# EAGLE design BlockController (EAGLE 7.6.0)
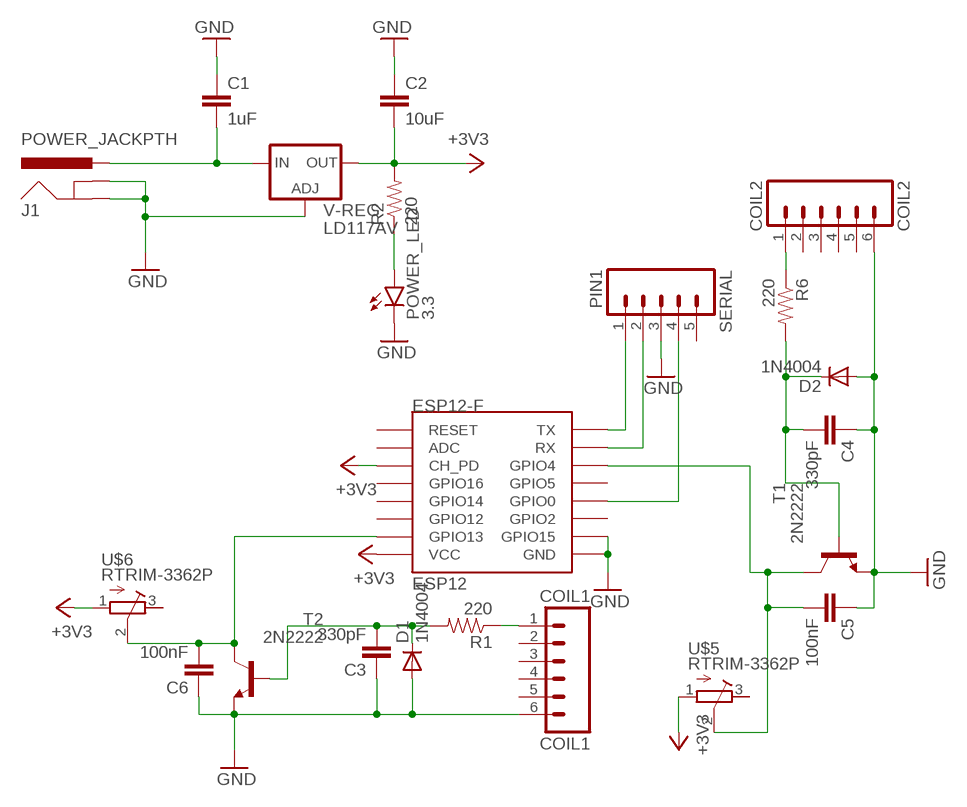
[diagram p0: schematic, sheet 1]

## Parts
C1  1uF  CAPPTH  [CAP-PTH-SMALL]
C2  10uF  CAPPTH  [CAP-PTH-SMALL]
C3  330pF  CAPPTH  [CAP-PTH-SMALL]
C4  330pF  CAPPTH  [CAP-PTH-SMALL]
C5  100nF  CAPPTH  [CAP-PTH-SMALL]
C6  100nF  CAPPTH  [CAP-PTH-SMALL]
COIL1  COIL1  M06  [06P]
COIL2  COIL2  M06  [06P]
D1  1N4004  [DO41-10]
D2  1N4004  [DO41-10]
ESP12-F  ESP12  [ESP12]
J1  POWER_JACKPTH  [POWER_JACK_PTH]
POWER_LED  3.3  LED5MM  [LED5MM]
R1  220  RESISTORPTH-1/4W  [AXIAL-0.4]
R2  220  RESISTORPTH-1/4W  [AXIAL-0.4]
R6  220  RESISTORPTH-1/4W  [AXIAL-0.4]
SERIAL  PIN1  M05  [05P]
T1  2N2222  [TO18]
T2  2N2222  [TO18]
U$5  RTRIM-3362P  [RTRIM3362P]
U$6  RTRIM-3362P  [RTRIM3362P]
V-REG  LD117AV  [TO220L1]

## Nets
+3V3: C2.2 ESP12-F.CH_PD ESP12-F.VCC R2.P$2 U$5.1 U$6.1 V-REG.2(OUT)
GND: C1.1 C2.1 C3.1 C4.1 C5.1 C6.1 COIL1.6 COIL2.6 D1.A D2.A ESP12-F.GND ESP12-F.GPIO15 J1.GND J1.GNDBREAK POWER_LED.K(C) SERIAL.3 T1.1(E) T2.1(E) V-REG.1(ADJ)
N$1: COIL1.1 R1.P$1
N$2: C3.2 D1.C R1.P$2 T2.2(B)
N$3: C4.2 D2.C R6.P$2 T1.2(B)
N$5: COIL2.1 R6.P$1
N$6: C5.2 ESP12-F.GPIO4 T1.3(C) U$5.2
N$7: POWER_LED.A R2.P$1
N$8: ESP12-F.TX SERIAL.1
N$9: ESP12-F.RX SERIAL.2
N$10: ESP12-F.GPIO0 SERIAL.4
N$18: C1.2 J1.PWR V-REG.3(IN)
N$20: C6.2 ESP12-F.GPIO13 T2.3(C) U$6.2
Unconnected: COIL1.2 COIL1.3 COIL1.4 COIL1.5 COIL2.2 COIL2.3 COIL2.4 COIL2.5 ESP12-F.ADC ESP12-F.GPIO2 ESP12-F.GPIO5 ESP12-F.GPIO12 ESP12-F.GPIO14 ESP12-F.GPIO16 ESP12-F.RESET SERIAL.5 U$5.3 U$6.3

## Library data of the parts
C1-C6 = SparkFun-Capacitors:CAP: Capacitor Standard 0603 ceramic capacitor, and 0.1" leaded capacitor.
COIL1 COIL2 = con-amp-quick:M06: AMP QUICK CONNECTOR; OC_FARNELL: unknown; OC_NEWARK: unknown
D1 D2 = diode:1N4004: DIODE general purpose rectifier, 1 A
ESP12-F = esp8266modules:ESP12: ESP8266 Wifi module 12
J1 = SparkFun-Connectors:POWER_JACK: Power Jack This is the standard 5.5mm barrel jack for power. The PTH is the most common, proven, reliable, footprint. The Slot footprint only works if the mill layer is transmitted to the PCB fab house so be warned. Mating wall wart : TOL-00298 (and others); PROD_ID: CONN-08197
POWER_LED = SparkFun-LED:LED: LEDs Standard schematic elements and footprints for 5mm, 3mm, 1206, and 0603 sized LEDs. 5mm - Spark Fun Electronics SKU : COM-00529 (and others)
R1 R2 R6 = SparkFun-Resistors:RESISTOR: Resistor Basic schematic elements and footprints for 0603, 1206, and PTH resistors.
SERIAL = con-amp-quick:M05: AMP QUICK CONNECTOR; OC_FARNELL: unknown; OC_NEWARK: unknown
T1 T2 = transistor-neu-to92:2N2222: NPN TRANSISTOR
U$5 U$6 = GeekAmmo:RTRIM: BOURNS 3362 - 1/4" Square Trimpot® Trimming Potentiometer
V-REG = v-reg:LD117A?*: Low drop fixed and adjustable positive voltage regulators 1 A Source: http://www.st.com/stonline/products/literature/ds/7194/ld1117axx.pdf

## Board
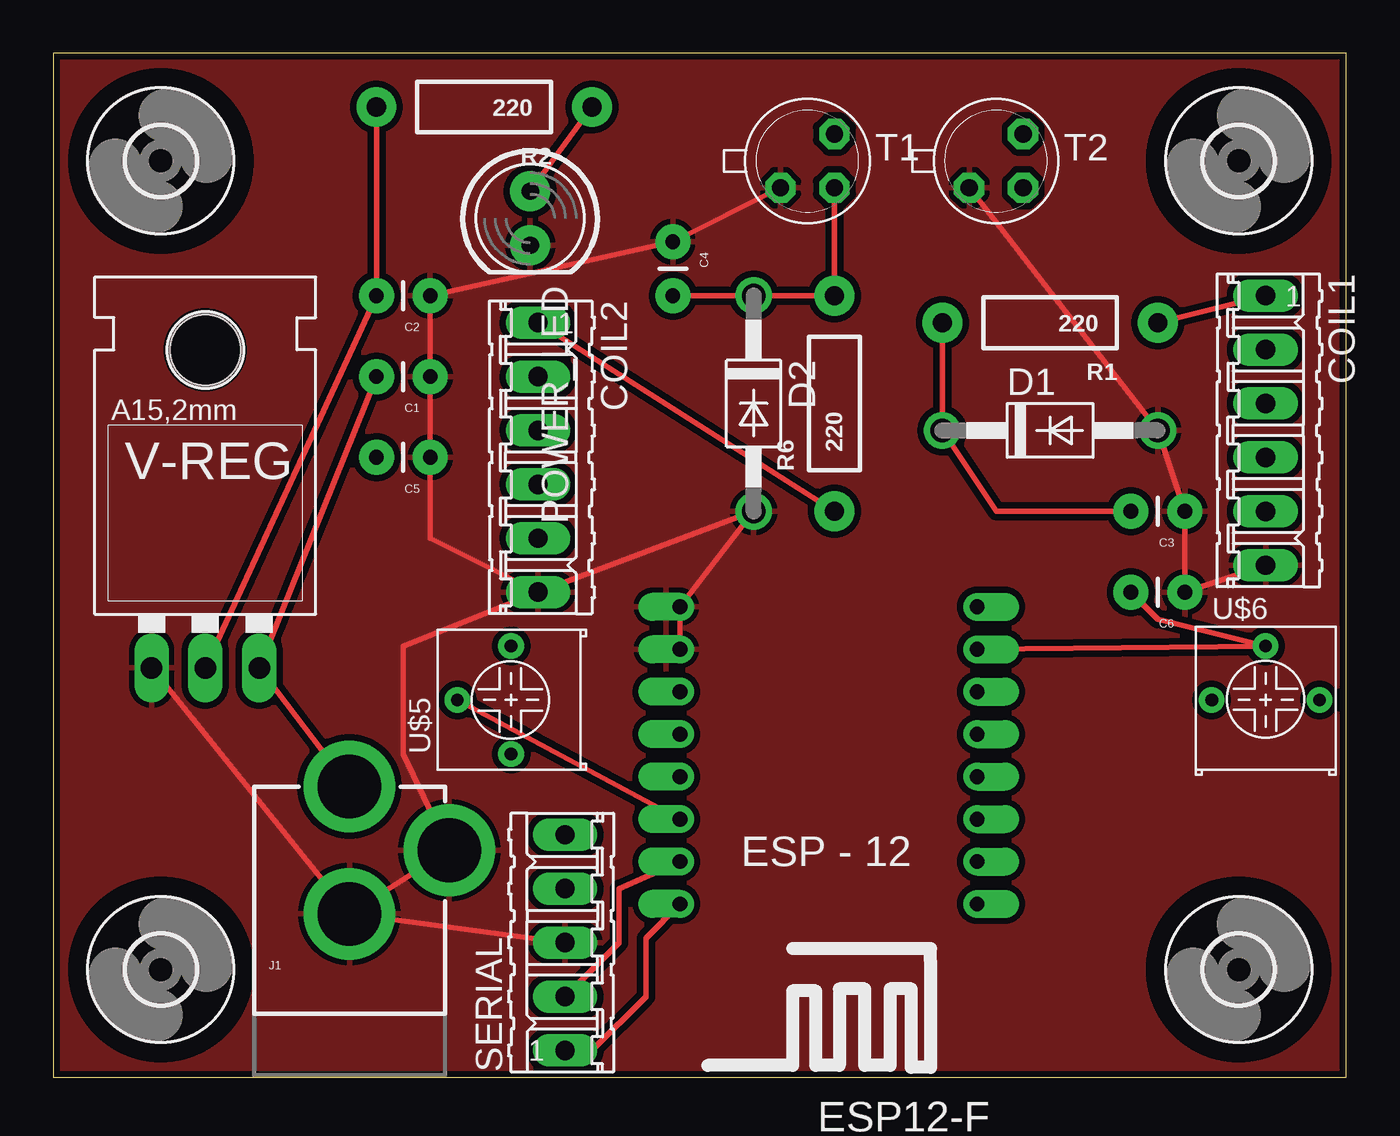
[diagram p1: board, top side]
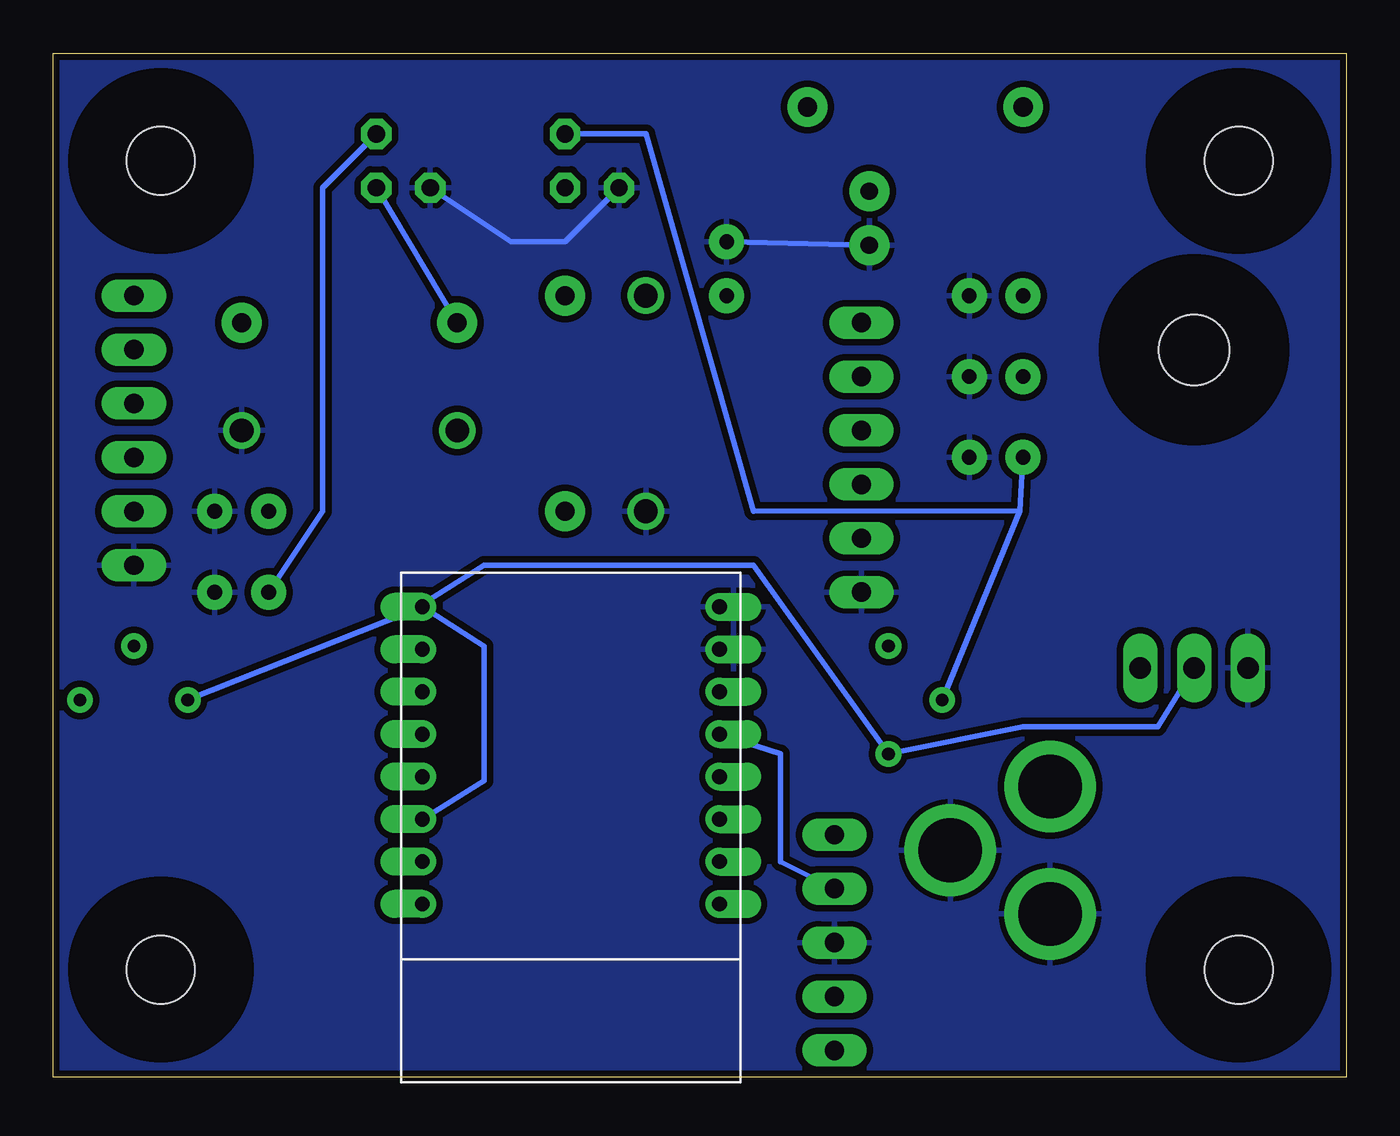
[diagram p2: board, bottom side, seen from below]

Size 60.96 x 48.26 mm. Coordinates in mm from the lower left corner, seen from the top.
Outline: 0,0 60.96,0 60.96,48.26 0,48.25 0,0
Copper layers (1*16): Top 0.035mm / dielectric 1.5mm / Bottom 0.035mm
Design rules "SparkFun": minimum track width 8mil, minimum drill 20mil, track to track 8mil, track to pad 8mil, pad to pad 8mil, via to via 8mil, smd to smd 8mil, copper to edge 8mil, drill to drill 8mil, minimum pad ring 12mil, minimum via ring 10mil, stop-mask expansion 4mil, vias tented up to drill 20mil, thermal gap 10mil

### Footprints (pad centres in the part's own frame; a part is rotated, then mirrored left to right if it is on the bottom)
CAP-PTH-SMALL = drill 0.7 pad 1.651: 1 0,0; 2 2.54,0
06P = drill 0.914 long: 1 -6.35,0; 2 -3.81,0; 3 -1.27,0; 4 1.27,0; 5 3.81,0; 6 6.35,0
DO41-10 = drill 1.118: A 5.08,0; C -5.08,0
ESP12 = drill 0.7 offset: ADC -7.1,3.8; CH_PD -7.1,1.8; GND 6.9,-8.2; GPIO0 6.9,-2.2; GPIO2 6.9,-4.2; GPIO4 6.9,1.8; GPIO5 6.9,-0.2; GPIO12 -7.1,-4.2; GPIO13 -7.1,-6.2; GPIO14 -7.1,-2.2; GPIO15 6.9,-6.2; GPIO16 -7.1,-0.2; RESET -7.1,5.8; RX 6.9,3.8; TX 6.9,5.8; VCC -7.1,-8.2
POWER_JACK_PTH = drill 2.997 pad 4.318: GND 0,7.7; GNDBREAK 4.7,10.7; PWR 0,13.7
LED5MM = drill 0.813 pad 1.88: A -1.27,0; K 1.27,0
AXIAL-0.4 = drill 0.9 pad 1.88: P$1 -5.08,0; P$2 5.08,0
05P = drill 0.914 long: 1 -5.08,0; 2 -2.54,0; 3 0,0; 4 2.54,0; 5 5.08,0
TO18 = drill 0.813 octagon: 1 -1.27,-1.27; 2 1.27,-1.27; 3 1.27,1.27
3,2 = hole 3.2: 0,0
RTRIM3362P = drill 0.6: 1 -2.54,-2.54; 2 0,0; 3 2.54,-2.54
TO220L1 = drill 1.016 long: 1 -2.54,-3.81; 2 0,-3.81; 3 2.54,-3.81 | hole 3.302: 0,11.176

### Placement (x,y rotation side)
C1  17.78,33.02 180 top
C2  17.78,36.83 180 top
C3  53.34,26.67 180 top
C4  29.21,39.37 270 top
C5  17.78,29.21 180 top
C6  53.34,22.86 180 top
COIL1  57.15,30.48 270 top
COIL2  22.86,29.21 270 top
D1  46.99,30.48 0 top
D2  33.02,31.75 270 top
ESP12-F  36.45,13.97 180 top
J1  13.97,0 0 top
POWER_LED  22.49,40.48 270 top
R1  46.99,35.56 180 top
R2  20.32,45.72 180 top
R6  36.83,31.75 90 top
SERIAL  24.13,6.35 90 top
T1  35.56,43.18 0 top
T2  44.45,43.18 0 top
U$1  [3,2]  5.08,43.18 0 top
U$2  [3,2]  55.88,43.18 0 top
U$3  [3,2]  55.88,5.08 0 top
U$4  [3,2]  5.08,5.08 0 top
U$5  19.05,17.78 90 top
U$6  57.15,20.32 0 top
V-REG  7.18,23.1 0 top

### Tracks (layer width: path | path; a pad name or v marks a point on that pad's centre or on a via)
+3V3
  Top 0.254: V-REG.2 C2.2 R2.P$2
  Bottom 0.254: V-REG.2 8.89,16.51 15.24,16.51 U$5.1 27.94,24.13 40.64,24.13 44.09,21.96 | U$6.1 44.09,21.96 | 44.09,21.96 ESP12-F.VCC 40.64,20.32 40.64,13.97 ESP12-F.CH_PD
GND
  Top 0.254: J1.GND J1.GNDBREAK 16.51,15.24 16.51,20.32 COIL2.6 | ESP12-F.GPIO15 ESP12-F.GND D2.A COIL2.6 | J1.GND V-REG.1 | J1.GND SERIAL.3 | COIL1.6 C6.1 C3.1 D1.A T2.1 | COIL2.6 17.78,25.4 C5.1 C1.1 C2.1 C4.1 T1.1
  Bottom 0.254: POWER_LED.K C4.1 | T1.1 36.83,39.37 39.37,39.37 T2.1
  pour Top (isolate 0.305): 0,48.26 60.96,48.26 60.96,0 0,0
  pour Bottom (isolate 0.305): 0,48.26 60.96,48.26 60.96,0 0,0
  pour Top (isolate 0.305): 0,0 0,48.26 60.96,48.26 60.96,0
  pour Bottom (isolate 0.305): 0,0 0,48.26 60.96,48.26 60.96,0
N$1
  Top 0.254: R1.P$1 COIL1.1
N$2
  Top 0.254: C3.2 44.45,26.67 D1.C R1.P$2
  Bottom 0.254: R1.P$2 T2.2
N$3
  Top 0.254: T1.2 R6.P$2 D2.C C4.2
N$5
  Top 0.254: R6.P$1 COIL2.1
N$6
  Top 0.254: U$5.2 ESP12-F.GPIO4
  Bottom 0.254: C5.2 15.4,26.69 | 15.4,26.69 U$5.2 | T1.3 33.02,44.45 27.94,26.67 15.4,26.69
N$7
  Top 0.254: POWER_LED.A R2.P$1
N$8
  Top 0.254: SERIAL.1 25.4,1.27 27.94,3.81 27.94,6.56 ESP12-F.TX
N$9
  Top 0.254: SERIAL.2 26.67,6.35 26.67,8.89 ESP12-F.RX
N$10
  Bottom 0.254: SERIAL.4 26.67,10.16 26.67,15.24 ESP12-F.GPIO0
N$18
  Top 0.254: J1.PWR V-REG.3 C1.2
N$20
  Top 0.254: C6.2 52.07,21.59 U$6.2 ESP12-F.GPIO13
  Bottom 0.254: C6.2 48.26,26.67 48.26,41.91 T2.3